# EAGLE schematic MARK-II board (EAGLE 8.5.0)

## Sheet 1 of 6
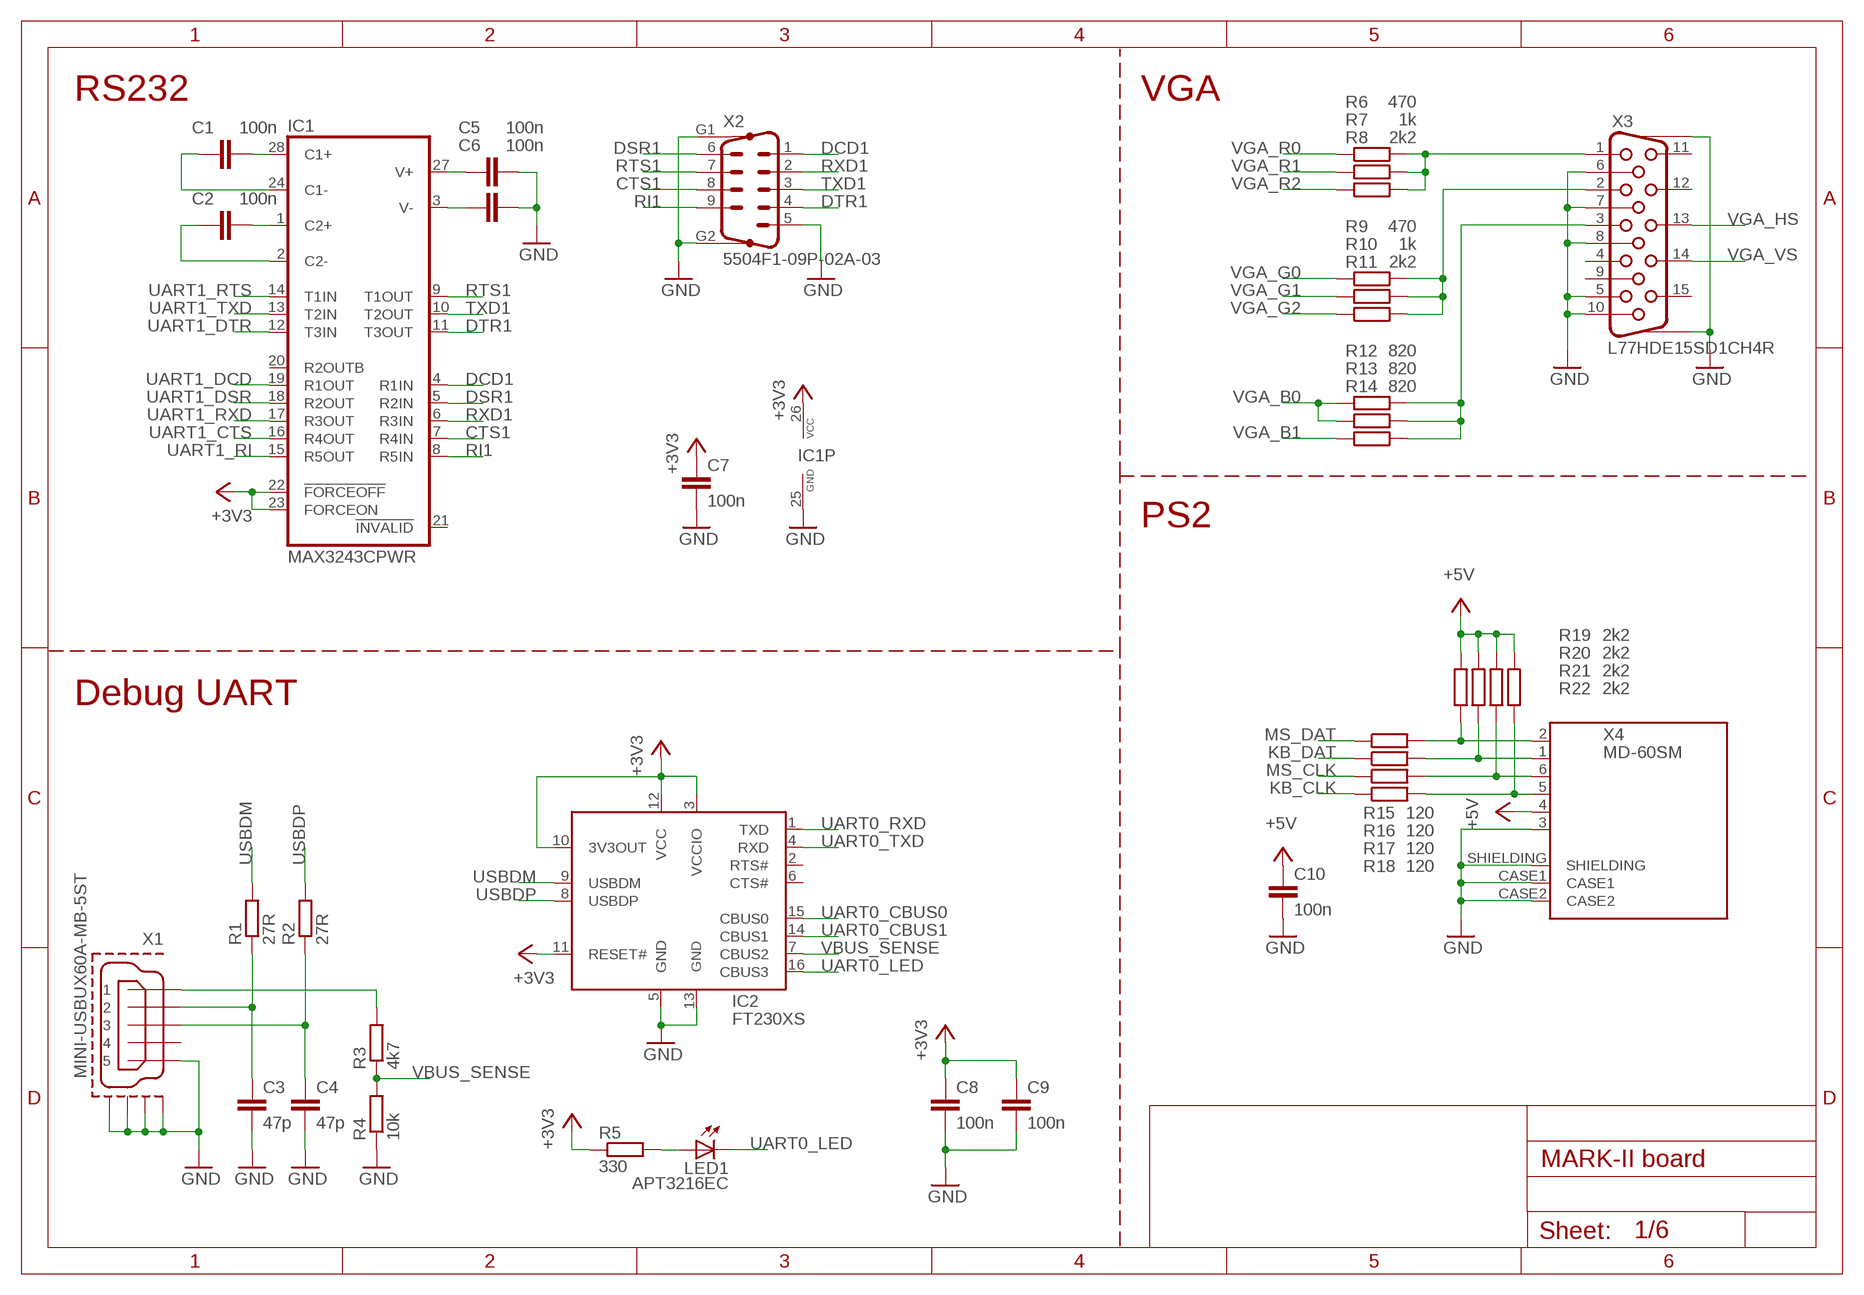
[diagram p0: schematic, sheet 1]

### Parts
C1  100n  CC0603  [C0603]
C2  100n  CC0603  [C0603]
C3  47p  CC0603  [C0603]
C4  47p  CC0603  [C0603]
C5  100n  CC0603  [C0603]
C6  100n  CC0603  [C0603]
C7  100n  CC0603  [C0603]
C8  100n  CC0603  [C0603]
C9  100n  CC0603  [C0603]
C10  100n  CC0603  [C0603]
IC1  MAX3243CPWR  MAX3243UI  [TSSOP28]
IC2  FT230XS  [SSOP16]
LED1  APT3216EC  LEDSMD  [1206]
R1  27R  RR0603  [R0603]
R2  27R  RR0603  [R0603]
R3  4k7  RR0603  [R0603]
R4  10k  RR0603  [R0603]
R5  330  RR0603  [R0603]
R6  470  RR0603  [R0603]
R7  1k  RR0603  [R0603]
R8  2k2  RR0603  [R0603]
R9  470  RR0603  [R0603]
R10  1k  RR0603  [R0603]
R11  2k2  RR0603  [R0603]
R12  820  RR0603  [R0603]
R13  820  RR0603  [R0603]
R14  820  RR0603  [R0603]
R15  120  RR0603  [R0603]
R16  120  RR0603  [R0603]
R17  120  RR0603  [R0603]
R18  120  RR0603  [R0603]
R19  2k2  RR0603  [R0603]
R20  2k2  RR0603  [R0603]
R21  2k2  RR0603  [R0603]
R22  2k2  RR0603  [R0603]
X1  MINI-USBUX60A-MB-5ST  [UX60A-MB-5ST]
X2  5504F1-09P-02A-03  M09  [M09HP]
X3  L77HDE15SD1CH4R  HF15H  [HDF15H]
X4  MD-60SM  MINIDIN_6  [MINIDIN_6_3GND]

### Nets
+3V3 [power]: C7.1 C8.1 C9.1 IC1.22(!FORCEOFF) IC1.23(FORCEON) IC1.26(VCC) IC2.3(VCCIO) IC2.10(3V3OUT) IC2.11(RESET#) IC2.12(VCC) R5.1 ; also sheet 2,3,4,5,6
+5V [power]: C10.1 R19.2 R20.2 R21.2 R22.2 X4.4 ; also sheet 4,6
CTS1 [signal]: IC1.7(R4IN) X2.8
DCD1 [signal]: IC1.4(R1IN) X2.1
DSR1 [signal]: IC1.5(R2IN) X2.6
DTR1 [signal]: IC1.11(T3OUT) X2.4
GND [power]: C3.2 C4.2 C5.2 C6.2 C7.2 C8.2 C9.2 C10.2 IC1.25(GND) IC2.5(GND) IC2.13(GND_1) R4.1 X1.5 X1.M1(GND1) X1.M2(GND2) X1.M3(GND3) X1.M4(GND4) X2.5 X2.G1 X2.G2 X3.5 X3.6 X3.7 X3.8 X3.10 X3.SCH1 X3.SCH2 X4.3 X4.CASE1 X4.CASE2 X4.SHIELDING ; also sheet 2,3,4,5,6
KB_CLK [signal]: R18.1 ; also sheet 5
KB_DAT [signal]: R16.1 ; also sheet 5
MS_CLK [signal]: R17.1 ; also sheet 5
MS_DAT [signal]: R15.1 ; also sheet 5
N$1 [signal]: C1.2 IC1.28(C1+)
N$2 [signal]: C2.2 IC1.1(C2+)
N$3 [signal]: C1.1 IC1.24(C1-)
N$4 [signal]: R16.2 R20.1 X4.1
N$5 [signal]: R12.2 R13.2 R14.2 X3.3
N$6 [signal]: C2.1 IC1.2(C2-)
N$7 [signal]: C5.1 IC1.27(V+)
N$8 [signal]: C6.1 IC1.3(V-)
N$9 [signal]: R18.2 R22.1 X4.5
N$10 [signal]: R9.2 R10.2 R11.2 X3.2
N$13 [signal]: R6.2 R7.2 R8.2 X3.1
N$20 [signal]: R3.2 X1.1
N$23 [signal]: C3.1 R1.1 X1.2
N$24 [signal]: C4.1 R2.1 X1.3
N$33 [signal]: R17.2 R21.1 X4.6
N$34 [signal]: R15.2 R19.1 X4.2
N$36 [signal]: LED1.A R5.2
RI1 [signal]: IC1.8(R5IN) X2.9
RTS1 [signal]: IC1.9(T1OUT) X2.7
RXD1 [signal]: IC1.6(R3IN) X2.2
TXD1 [signal]: IC1.10(T2OUT) X2.3
UART0_CBUS0 [signal]: IC2.15(CBUS0) ; also sheet 5
UART0_CBUS1 [signal]: IC2.14(CBUS1) ; also sheet 5
UART0_LED [signal]: IC2.16(CBUS3) LED1.C ; also sheet 4
UART0_RXD [signal]: IC2.1(TXD) ; also sheet 5
UART0_TXD [signal]: IC2.4(RXD) ; also sheet 5
UART1_CTS [signal]: IC1.16(R4OUT) ; also sheet 5
UART1_DCD [signal]: IC1.19(R1OUT) ; also sheet 5
UART1_DSR [signal]: IC1.18(R2OUT) ; also sheet 5
UART1_DTR [signal]: IC1.12(T3IN) ; also sheet 5
UART1_RI [signal]: IC1.15(R5OUT) ; also sheet 5
UART1_RTS [signal]: IC1.14(T1IN) ; also sheet 5
UART1_RXD [signal]: IC1.17(R3OUT) ; also sheet 5
UART1_TXD [signal]: IC1.13(T2IN) ; also sheet 5
USBDM [signal]: IC2.9(USBDM) R1.2
USBDP [signal]: IC2.8(USBDP) R2.2
VBUS_SENSE [signal]: IC2.7(CBUS2) R3.1 R4.2
VGA_B0 [signal]: R12.1 R13.1 ; also sheet 5
VGA_B1 [signal]: R14.1 ; also sheet 5
VGA_G0 [signal]: R9.1 ; also sheet 5
VGA_G1 [signal]: R10.1 ; also sheet 5
VGA_G2 [signal]: R11.1 ; also sheet 5
VGA_HS [signal]: X3.13 ; also sheet 5
VGA_R0 [signal]: R6.1 ; also sheet 5
VGA_R1 [signal]: R7.1 ; also sheet 5
VGA_R2 [signal]: R8.1 ; also sheet 5
VGA_VS [signal]: X3.14 ; also sheet 5
Unconnected: IC1.20(R2OUTB) IC1.21(!INVALID) IC2.2(RTS#) IC2.6(CTS#) X1.4 X3.4 X3.9 X3.11 X3.12 X3.15

### Notes on the sheet
- RS232 | VGA
- PS2
- Debug UART

## Sheet 2 of 6
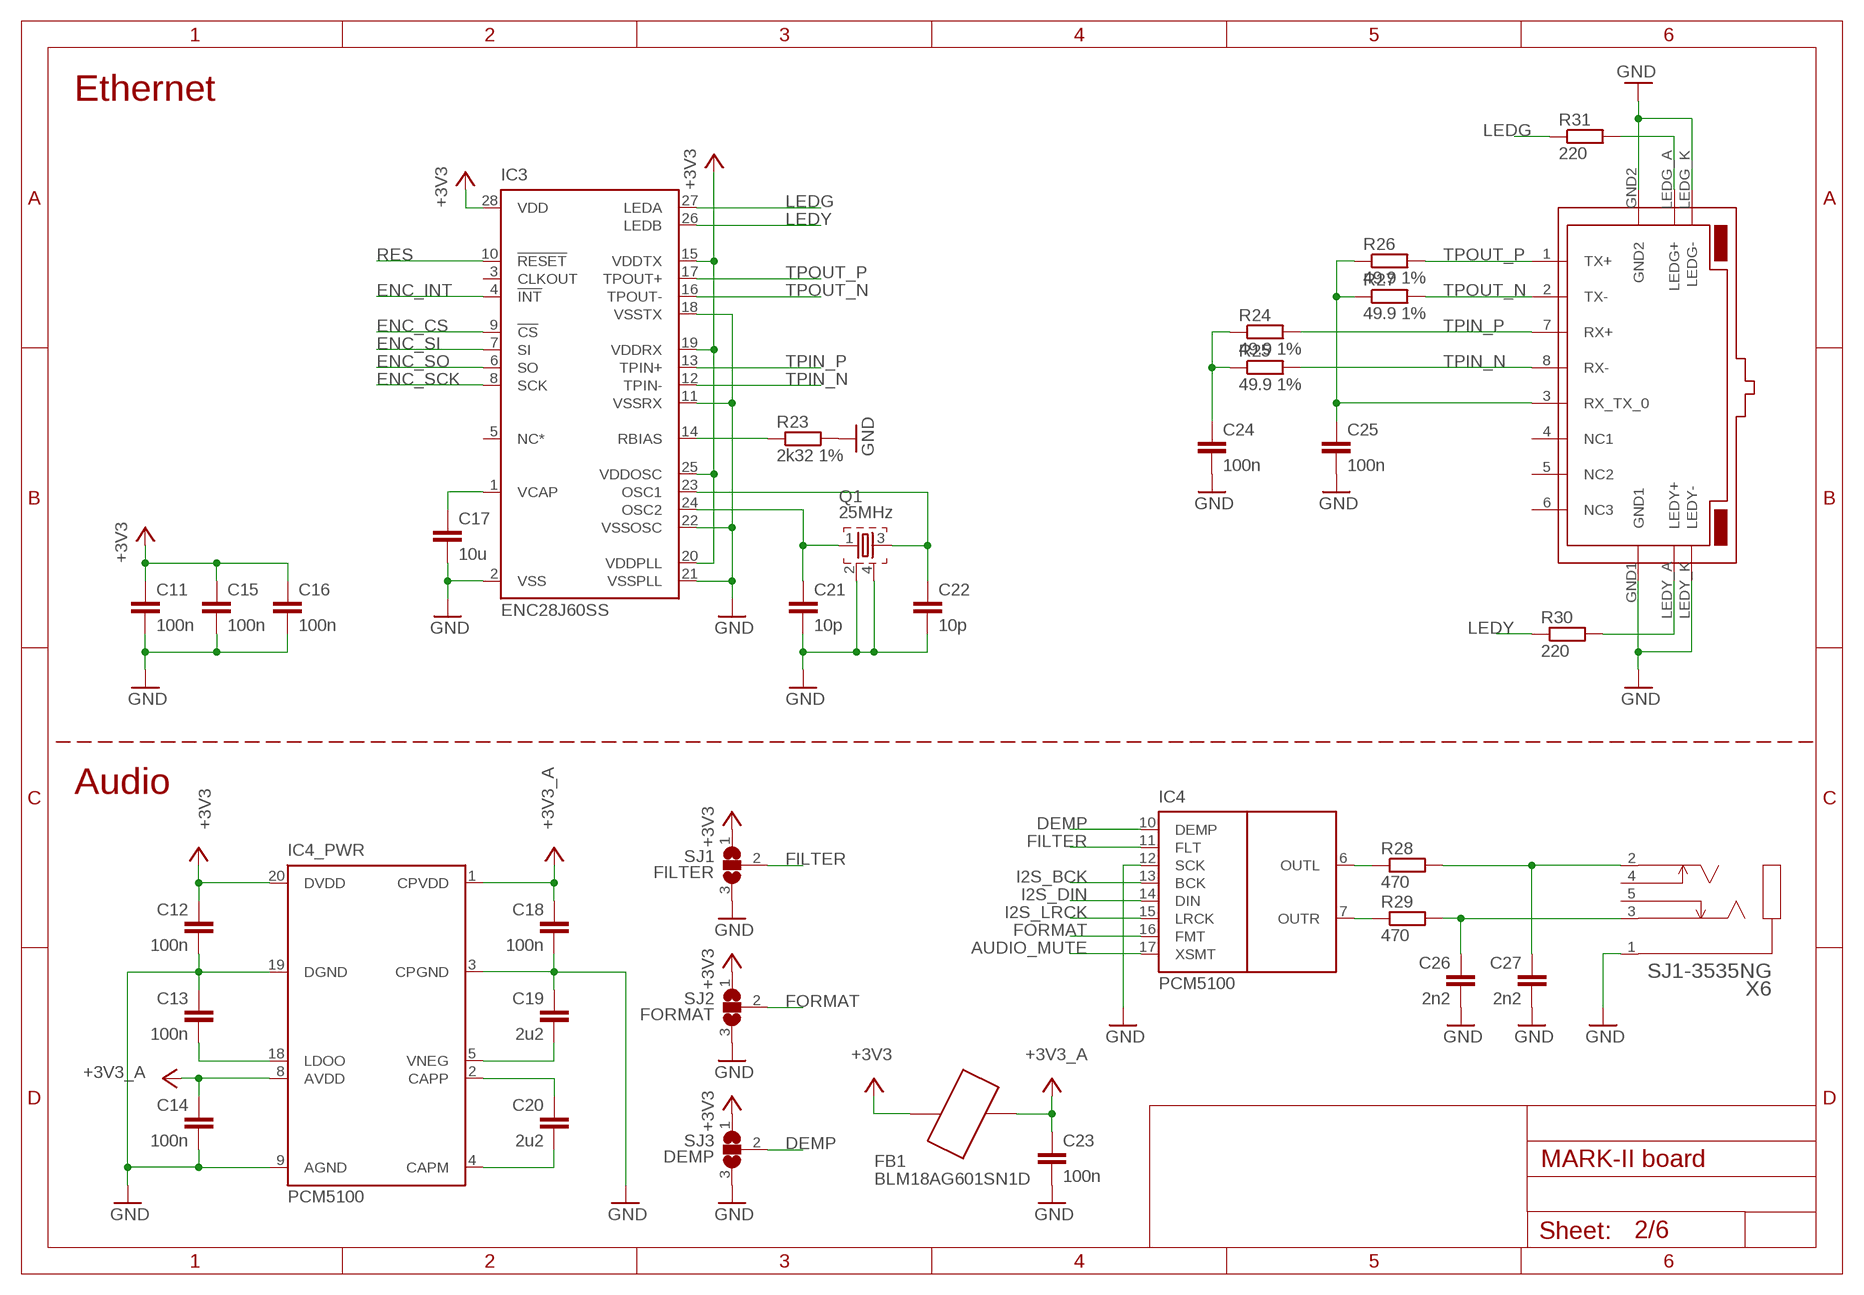
[diagram p1: schematic, sheet 2]

### Parts
C11  100n  CC0603  [C0603]
C12  100n  CC0603  [C0603]
C13  100n  CC0603  [C0603]
C14  100n  CC0603  [C0603]
C15  100n  CC0603  [C0603]
C16  100n  CC0603  [C0603]
C17  10u  CC0603  [C0603]
C18  100n  CC0603  [C0603]
C19  2u2  CC0603  [C0603]
C20  2u2  CC0603  [C0603]
C21  10p  CC0603  [C0603]
C22  10p  CC0603  [C0603]
C23  100n  CC0603  [C0603]
C24  100n  CC0603  [C0603]
C25  100n  CC0603  [C0603]
C26  2n2  CC0603  [C0603]
C27  2n2  CC0603  [C0603]
FB1  BLM18AG601SN1D  FERRITE_BEAD603  [R0603]
IC3  ENC28J60SS  [SSOP28]
IC4  PCM5100  [TSSOP20]
Q1  25MHz  CRYSTALS-GND-LID-CFPX-180  [3.4X2.7-4-PAD]
R23  2k32 1%  RR0603  [R0603]
R24  49.9 1%  RR0603  [R0603]
R25  49.9 1%  RR0603  [R0603]
R26  49.9 1%  RR0603  [R0603]
R27  49.9 1%  RR0603  [R0603]
R28  470  RR0603  [R0603]
R29  470  RR0603  [R0603]
R30  220  RR0603  [R0603]
R31  220  RR0603  [R0603]
SJ1  FILTER  SJ2W  [SJ_2]
SJ2  FORMAT  SJ2W  [SJ_2]
SJ3  DEMP  SJ2W  [SJ_2]
X5  RB1-125BAG1A  [RB1-125BAG1A]
X6  SJ1-3535NG  [JACK]

### Nets
+3V3 [power]: C11.1 C12.1 C15.1 C16.1 FB1.1 IC3.15(VDDTX) IC3.19(VDDRX) IC3.20(VDDPLL) IC3.25(VDDOSC) IC3.28(VDD) IC4.20(DVDD) SJ1.1 SJ2.1 SJ3.1 ; also sheet 1,3,4,5,6
+3V3_A [power]: C14.1 C18.1 C23.1 FB1.2 IC4.1(CPVDD) IC4.8(AVDD)
AUDIO_MUTE [signal]: IC4.17(XSMT) ; also sheet 6
DEMP [signal]: IC4.10(DEMP) SJ3.2
ENC_CS [signal]: IC3.9(!CS) ; also sheet 5
ENC_INT [signal]: IC3.4(!INT) ; also sheet 5
ENC_SCK [signal]: IC3.8(SCK) ; also sheet 5
ENC_SI [signal]: IC3.7(SI) ; also sheet 5
ENC_SO [signal]: IC3.6(SO) ; also sheet 5
FILTER [signal]: IC4.11(FLT) SJ1.2
FORMAT [signal]: IC4.16(FMT) SJ2.2
GND [power]: C11.2 C12.2 C13.1 C14.2 C15.2 C16.2 C17.2 C18.2 C19.1 C21.2 C22.2 C23.2 C24.2 C25.2 C26.2 C27.2 IC3.2(VSS) IC3.11(VSSRX) IC3.18(VSSTX) IC3.21(VSSPLL) IC3.22(VSSOSC) IC4.3(CPGND) IC4.9(AGND) IC4.12(SCK) IC4.19(DGND) Q1.2 Q1.4 R23.2 SJ1.3 SJ2.3 SJ3.3 X5.GND1 X5.GND2 X5.LEDG_K(LEDG-) X5.LEDY_K(LEDY-) X6.1(SLEEVE) ; also sheet 1,3,4,5,6
I2S_BCK [signal]: IC4.13(BCK) ; also sheet 5
I2S_DIN [signal]: IC4.14(DIN) ; also sheet 5
I2S_LRCK [signal]: IC4.15(LRCK) ; also sheet 5
LEDG [signal]: IC3.27(LEDA) R31.1
LEDY [signal]: IC3.26(LEDB) R30.1
N$11 [signal]: C24.1 R24.1 R25.1
N$12 [signal]: C17.1 IC3.1(VCAP)
N$14 [signal]: R30.2 X5.LEDY_A(LEDY+)
N$15 [signal]: R31.2 X5.LEDG_A(LEDG+)
N$16 [signal]: C25.1 R26.1 R27.1 X5.3(RX_TX_0)
N$17 [signal]: IC3.14(RBIAS) R23.1
N$18 [signal]: C21.1 IC3.24(OSC2) Q1.1
N$19 [signal]: C22.1 IC3.23(OSC1) Q1.3
N$38 [signal]: C20.1 IC4.2(CAPP)
N$39 [signal]: C20.2 IC4.4(CAPM)
N$40 [signal]: C13.2 IC4.18(LDOO)
N$41 [signal]: IC4.6(OUTL) R28.1
N$42 [signal]: IC4.7(OUTR) R29.1
N$43 [signal]: C27.1 R28.2 X6.2(TIP)
N$44 [signal]: C26.1 R29.2 X6.3(RING)
N$45 [signal]: C19.2 IC4.5(VNEG)
RES [signal]: IC3.10(!RESET) ; also sheet 4,5
TPIN_N [signal]: IC3.12(TPIN-) R25.2 X5.8(RX-)
TPIN_P [signal]: IC3.13(TPIN+) R24.2 X5.7(RX+)
TPOUT_N [signal]: IC3.16(TPOUT-) R27.2 X5.2(TX-)
TPOUT_P [signal]: IC3.17(TPOUT+) R26.2 X5.1(TX+)
Unconnected: IC3.3(CLKOUT) IC3.5(NC*) X5.4(NC1) X5.5(NC2) X5.6(NC3) X6.4(TIP_SW) X6.5(RING_SW)

### Notes on the sheet
- Ethernet
- Audio

## Sheet 3 of 6
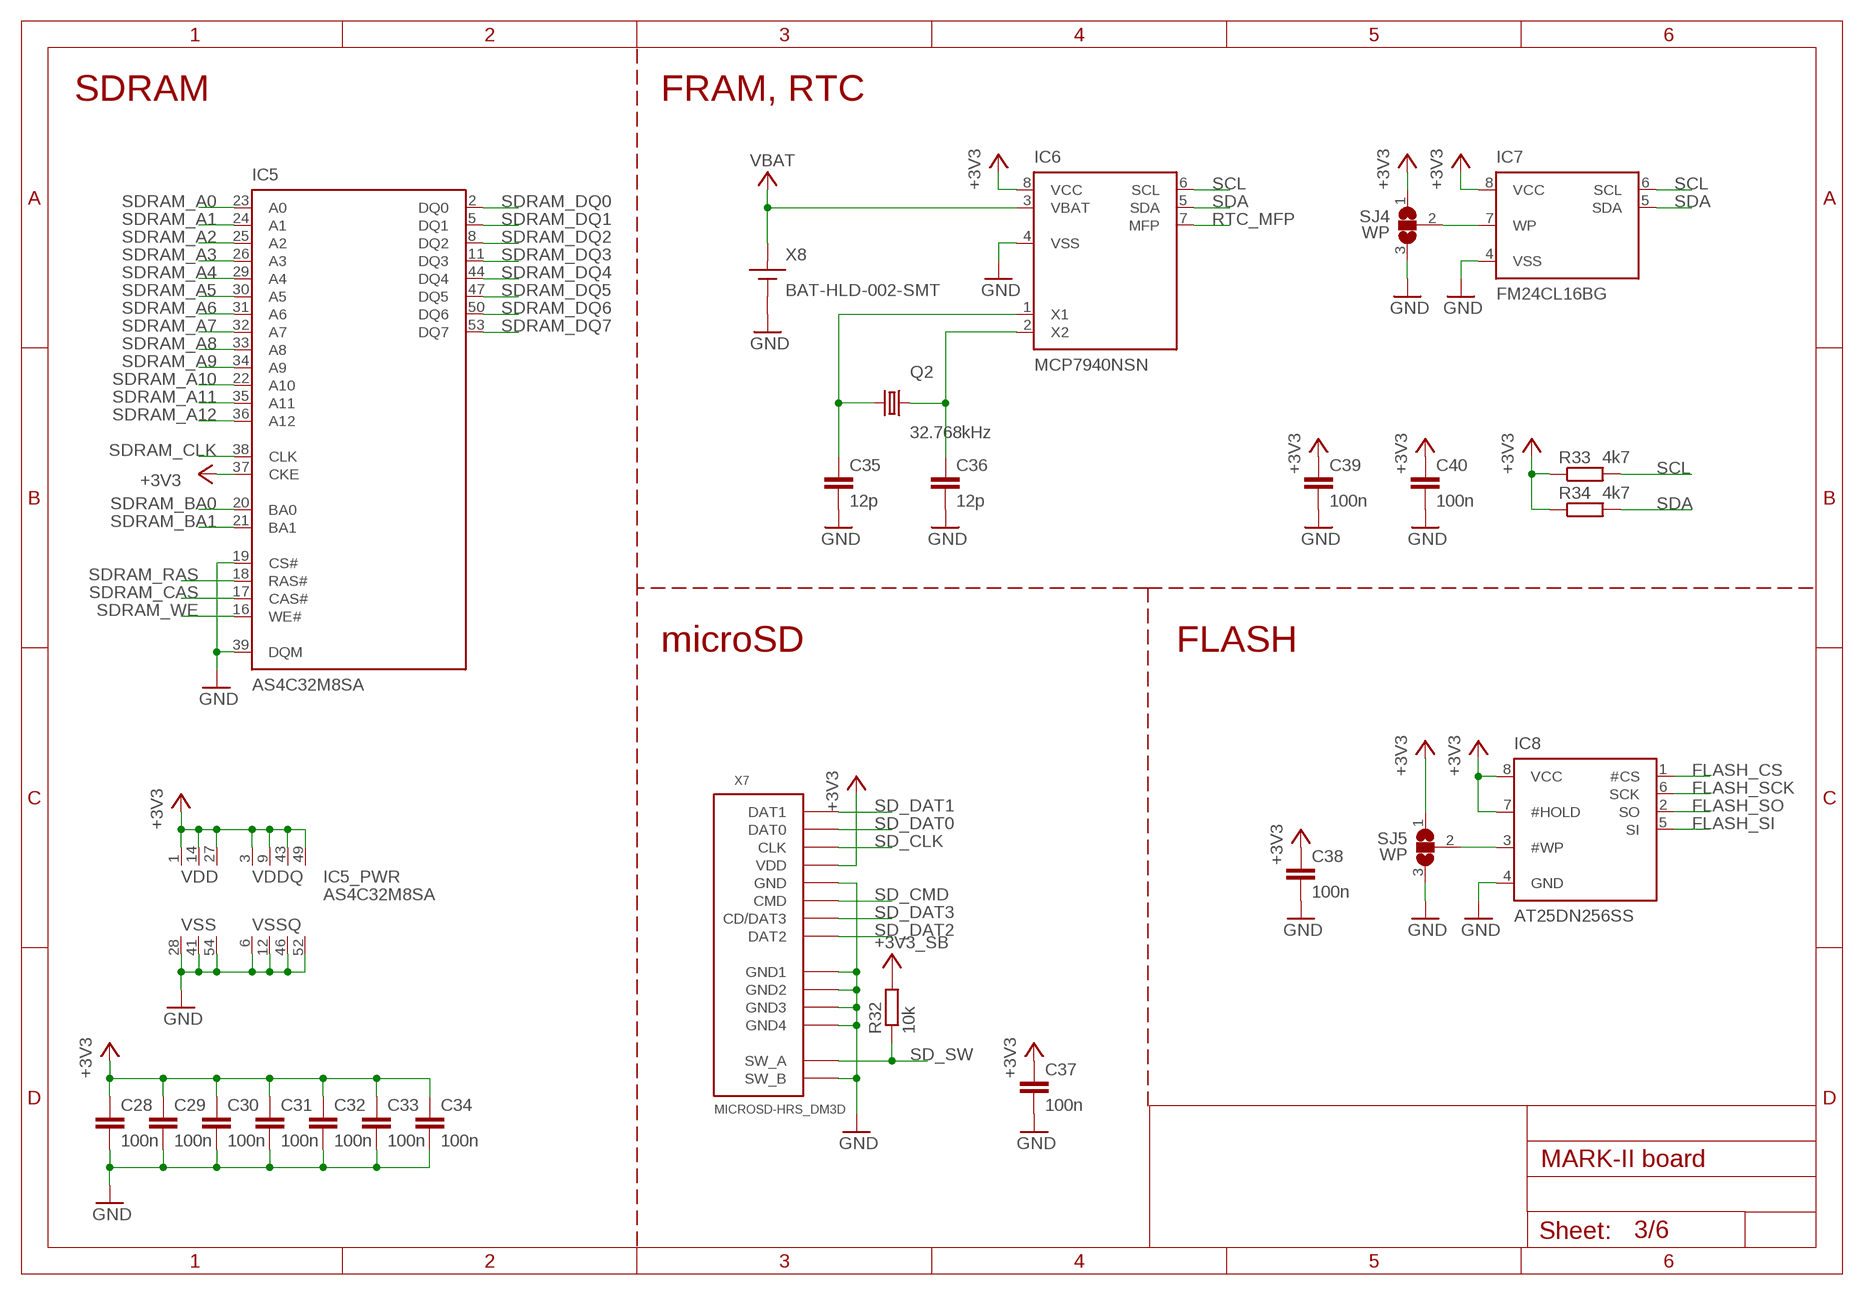
[diagram p2: schematic, sheet 3]

### Parts
C28  100n  CC0603  [C0603]
C29  100n  CC0603  [C0603]
C30  100n  CC0603  [C0603]
C31  100n  CC0603  [C0603]
C32  100n  CC0603  [C0603]
C33  100n  CC0603  [C0603]
C34  100n  CC0603  [C0603]
C35  12p  CC0603  [C0603]
C36  12p  CC0603  [C0603]
C37  100n  CC0603  [C0603]
C38  100n  CC0603  [C0603]
C39  100n  CC0603  [C0603]
C40  100n  CC0603  [C0603]
IC5  AS4C32M8SA  IS42S83200  [TSOP54]
IC6  MCP7940NSN  [SOIC8]
IC7  FM24CL16BG  [SOIC8]
IC8  AT25DN256SS  [SOIC8]
Q2  32.768kHz  CRYSTALS-NOGND-85SMX  [85SMX]
R32  10k  RR0603  [R0603]
R33  4k7  RR0603  [R0603]
R34  4k7  RR0603  [R0603]
SJ4  WP  SJ2W  [SJ_2]
SJ5  WP  SJ2W  [SJ_2]
X7  MICROSD-HRS_DM3D  [DM3D]
X8  BAT-HLD-002-SMT  [BAT-HLD-002-SMT]

### Nets
+3V3 [power]: C28.1 C29.1 C30.1 C31.1 C32.1 C33.1 C34.1 C37.1 C38.1 C39.1 C40.1 IC5.1(VDD0) IC5.3(VDDQ0) IC5.9(VDDQ1) IC5.14(VDD1) IC5.27(VDD2) IC5.37(CKE) IC5.43(VDDQ2) IC5.49(VDDQ3) IC6.8(VCC) IC7.8(VCC) IC8.7(#HOLD) IC8.8(VCC) R33.1 R34.1 SJ4.1 SJ5.1 X7.VDD ; also sheet 1,2,4,5,6
+3V3_SB [power]: R32.2 ; also sheet 6
FLASH_CS [signal]: IC8.1(#CS) ; also sheet 5
FLASH_SCK [signal]: IC8.6(SCK) ; also sheet 5
FLASH_SI [signal]: IC8.5(SI) ; also sheet 5
FLASH_SO [signal]: IC8.2(SO) ; also sheet 5
GND [power]: C28.2 C29.2 C30.2 C31.2 C32.2 C33.2 C34.2 C35.2 C36.2 C37.2 C38.2 C39.2 C40.2 IC5.6(VSSQ0) IC5.12(VSSQ1) IC5.19(CS#) IC5.28(VSS0) IC5.39(DQM) IC5.41(VSS1) IC5.46(VSSQ2) IC5.52(VSSQ3) IC5.54(VSS2) IC6.4(VSS) IC7.4(VSS) IC8.4(GND) SJ4.3 SJ5.3 X7.GND1 X7.GND2 X7.GND3 X7.GND4 X7.SW_B X7.VSS(GND) X8.N ; also sheet 1,2,4,5,6
N$25 [signal]: C35.1 IC6.1(X1) Q2.4
N$26 [signal]: C36.1 IC6.2(X2) Q2.1
N$35 [signal]: IC7.7(WP) SJ4.2
N$37 [signal]: IC8.3(#WP) SJ5.2
RTC_MFP [signal]: IC6.7(MFP) ; also sheet 5
SCL [signal]: IC6.6(SCL) IC7.6(SCL) R33.2 ; also sheet 5
SD_CLK [signal]: X7.CLK ; also sheet 5
SD_CMD [signal]: X7.CMD ; also sheet 5
SD_DAT0 [signal]: X7.DAT0 ; also sheet 5
SD_DAT1 [signal]: X7.DAT1 ; also sheet 5
SD_DAT2 [signal]: X7.DAT2 ; also sheet 5
SD_DAT3 [signal]: X7.CD/DAT3 ; also sheet 5
SD_SW [signal]: R32.1 X7.SW_A ; also sheet 6
SDA [signal]: IC6.5(SDA) IC7.5(SDA) R34.2 ; also sheet 5
SDRAM_A0 [sdram]: IC5.23(A0) ; also sheet 5
SDRAM_A1 [sdram]: IC5.24(A1) ; also sheet 5
SDRAM_A2 [sdram]: IC5.25(A2) ; also sheet 5
SDRAM_A3 [sdram]: IC5.26(A3) ; also sheet 5
SDRAM_A4 [sdram]: IC5.29(A4) ; also sheet 5
SDRAM_A5 [sdram]: IC5.30(A5) ; also sheet 5
SDRAM_A6 [sdram]: IC5.31(A6) ; also sheet 5
SDRAM_A7 [sdram]: IC5.32(A7) ; also sheet 5
SDRAM_A8 [sdram]: IC5.33(A8) ; also sheet 5
SDRAM_A9 [sdram]: IC5.34(A9) ; also sheet 5
SDRAM_A10 [sdram]: IC5.22(A10) ; also sheet 5
SDRAM_A11 [sdram]: IC5.35(A11) ; also sheet 5
SDRAM_A12 [sdram]: IC5.36(A12) ; also sheet 5
SDRAM_BA0 [sdram]: IC5.20(BA0) ; also sheet 5
SDRAM_BA1 [sdram]: IC5.21(BA1) ; also sheet 5
SDRAM_CAS [sdram]: IC5.17(CAS#) ; also sheet 5
SDRAM_CLK [sdram]: IC5.38(CLK) ; also sheet 5
SDRAM_DQ0 [sdram]: IC5.2(DQ0) ; also sheet 5
SDRAM_DQ1 [sdram]: IC5.5(DQ1) ; also sheet 5
SDRAM_DQ2 [sdram]: IC5.8(DQ2) ; also sheet 5
SDRAM_DQ3 [sdram]: IC5.11(DQ3) ; also sheet 5
SDRAM_DQ4 [sdram]: IC5.44(DQ4) ; also sheet 5
SDRAM_DQ5 [sdram]: IC5.47(DQ5) ; also sheet 5
SDRAM_DQ6 [sdram]: IC5.50(DQ6) ; also sheet 5
SDRAM_DQ7 [sdram]: IC5.53(DQ7) ; also sheet 5
SDRAM_RAS [sdram]: IC5.18(RAS#) ; also sheet 5
SDRAM_WE [sdram]: IC5.16(WE#) ; also sheet 5
VBAT [vbat]: IC6.3(VBAT) X8.P1(P) ; also sheet 6
Unconnected: IC7.1(NC1) IC7.2(NC2) IC7.3(NC3)

### Notes on the sheet
- SDRAM | FRAM, RTC
- microSD | FLASH

## Sheet 4 of 6
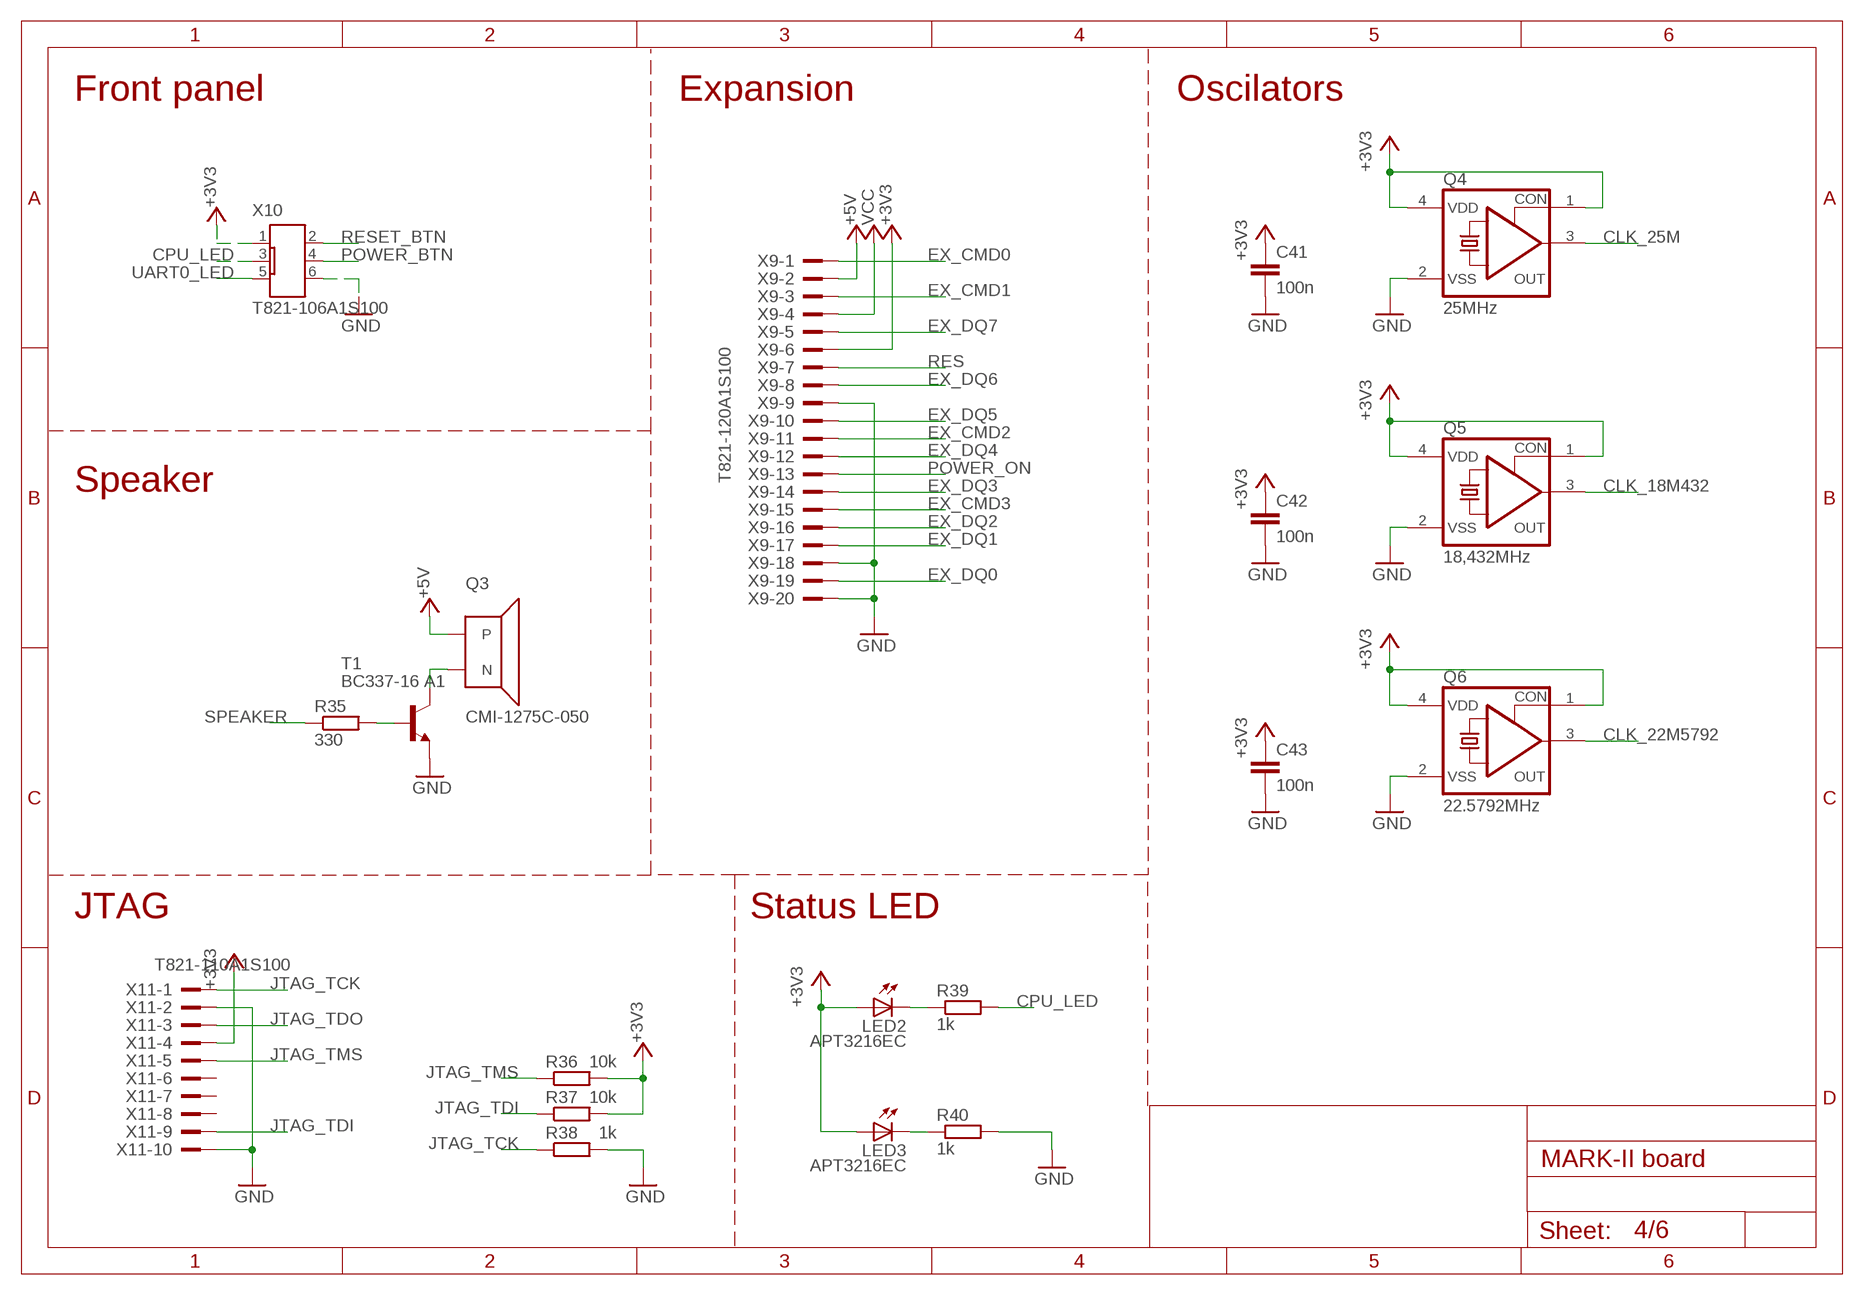
[diagram p3: schematic, sheet 4]

### Parts
C41  100n  CC0603  [C0603]
C42  100n  CC0603  [C0603]
C43  100n  CC0603  [C0603]
LED2  APT3216EC  LEDSMD  [1206]
LED3  APT3216EC  LEDSMD  [1206]
Q3  CMI-1275C-050  [BUUZZER]
Q4  25MHz  OSC-OE-CFPS-9  [5.2X3.4-4-PAD]
Q5  18,432MHz  OSC-OE-CFPS-9  [5.2X3.4-4-PAD]
Q6  22.5792MHz  OSC-OE-CFPS-9  [5.2X3.4-4-PAD]
R35  330  RR0603  [R0603]
R36  10k  RR0603  [R0603]
R37  10k  RR0603  [R0603]
R38  1k  RR0603  [R0603]
R39  1k  RR0603  [R0603]
R40  1k  RR0603  [R0603]
T1  BC337-16 A1  BC337  [TO92]
X9  T821-120A1S100  2520-  [PAK100/2500-20]
X10  T821-106A1S100  IDC_2306  [PAK100/2300-06]
X11  T821-110A1S100  2510-  [PAK100/2500-10]

### Nets
+3V3 [power]: C41.1 C42.1 C43.1 LED2.A LED3.A Q4.1(CON) Q4.4(VDD) Q5.1(CON) Q5.4(VDD) Q6.1(CON) Q6.4(VDD) R36.2 R37.2 X9.6 X10.1 X11.4 ; also sheet 1,2,3,5,6
+5V [power]: Q3.P X9.2 ; also sheet 1,6
CLK_18M432 [signal]: Q5.3(OUT) ; also sheet 5
CLK_22M5792 [signal]: Q6.3(OUT) ; also sheet 5
CLK_25M [signal]: Q4.3(OUT) ; also sheet 5
CPU_LED [signal]: R39.2 X10.3 ; also sheet 6
EX_CMD0 [signal]: X9.1 ; also sheet 5
EX_CMD1 [signal]: X9.3 ; also sheet 5
EX_CMD2 [signal]: X9.11 ; also sheet 5
EX_CMD3 [signal]: X9.15 ; also sheet 5
EX_DQ0 [signal]: X9.19 ; also sheet 5
EX_DQ1 [signal]: X9.17 ; also sheet 5
EX_DQ2 [signal]: X9.16 ; also sheet 5
EX_DQ3 [signal]: X9.14 ; also sheet 5
EX_DQ4 [signal]: X9.12 ; also sheet 5
EX_DQ5 [signal]: X9.10 ; also sheet 5
EX_DQ6 [signal]: X9.8 ; also sheet 5
EX_DQ7 [signal]: X9.5 ; also sheet 5
GND [power]: C41.2 C42.2 C43.2 Q4.2(VSS) Q5.2(VSS) Q6.2(VSS) R38.2 R40.2 T1.1(E) X9.9 X9.18 X9.20 X10.6 X11.2 X11.10 ; also sheet 1,2,3,5,6
JTAG_TCK [signal]: R38.1 X11.1 ; also sheet 5
JTAG_TDI [signal]: R37.1 X11.9 ; also sheet 5
JTAG_TDO [signal]: X11.3 ; also sheet 5
JTAG_TMS [signal]: R36.1 X11.5 ; also sheet 5
N$22 [signal]: LED3.C R40.1
N$27 [signal]: LED2.C R39.1
N$31 [signal]: Q3.N T1.3(C)
N$32 [signal]: R35.2 T1.2(B)
POWER_BTN [signal]: X10.4 ; also sheet 6
POWER_ON [signal]: X9.13 ; also sheet 6
RES [signal]: X9.7 ; also sheet 2,5
RESET_BTN [signal]: X10.2 ; also sheet 6
SPEAKER [signal]: R35.1 ; also sheet 6
UART0_LED [signal]: X10.5 ; also sheet 1
VCC [power]: X9.4 ; also sheet 6
Unconnected: X11.6 X11.7 X11.8

### Notes on the sheet
- Front panel | Expansion | Oscilators
- Speaker
- JTAG | Status LED

## Sheet 5 of 6
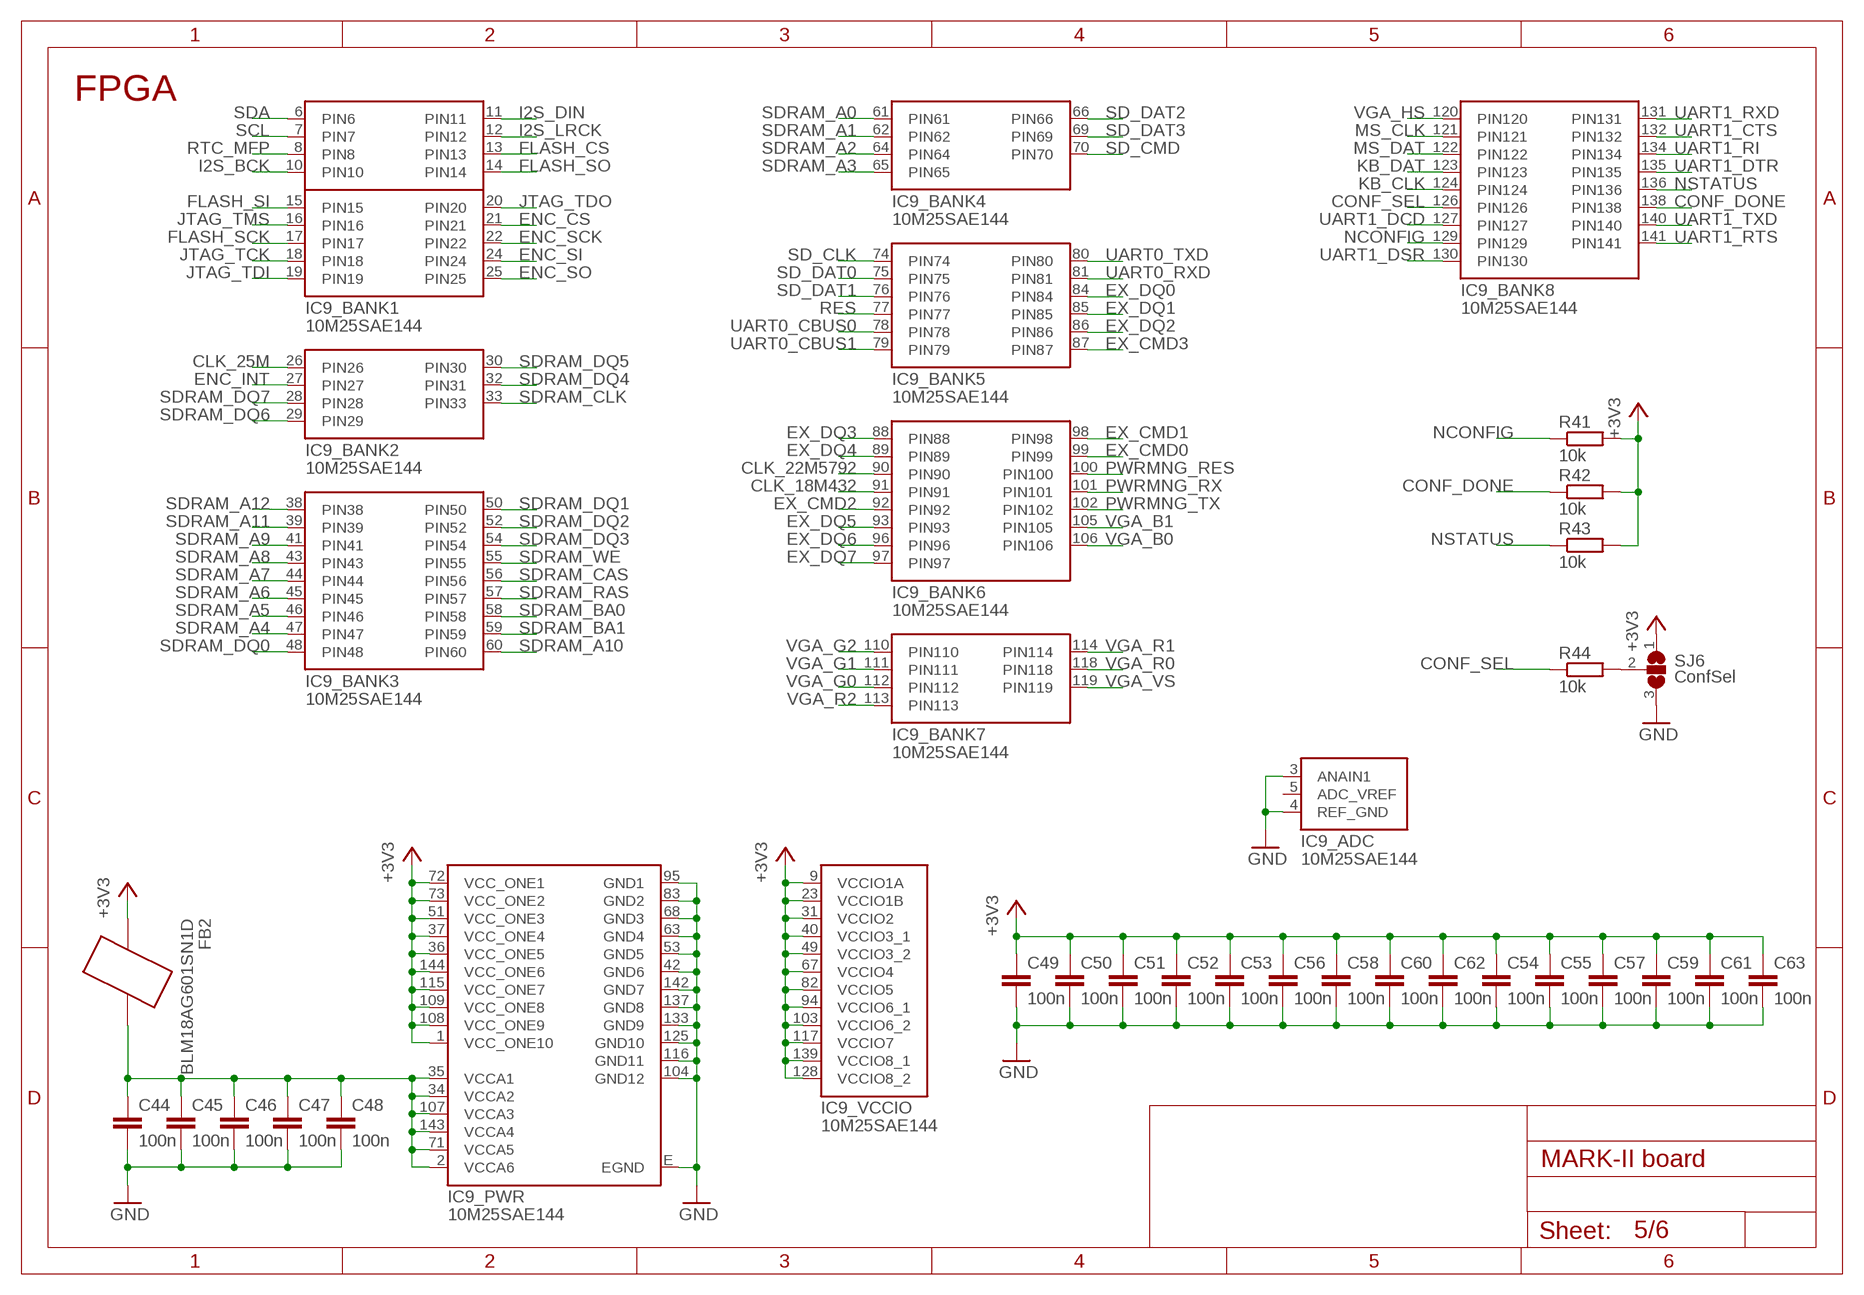
[diagram p4: schematic, sheet 5]

### Parts
C44  100n  CC0603  [C0603]
C45  100n  CC0603  [C0603]
C46  100n  CC0603  [C0603]
C47  100n  CC0603  [C0603]
C48  100n  CC0603  [C0603]
C49  100n  CC0603  [C0603]
C50  100n  CC0603  [C0603]
C51  100n  CC0603  [C0603]
C52  100n  CC0603  [C0603]
C53  100n  CC0603  [C0603]
C54  100n  CC0603  [C0603]
C55  100n  CC0603  [C0603]
C56  100n  CC0603  [C0603]
C57  100n  CC0603  [C0603]
C58  100n  CC0603  [C0603]
C59  100n  CC0603  [C0603]
C60  100n  CC0603  [C0603]
C61  100n  CC0603  [C0603]
C62  100n  CC0603  [C0603]
C63  100n  CC0603  [C0603]
FB2  BLM18AG601SN1D  FERRITE_BEAD603  [R0603]
IC9  10M25SAE144  [EQFP144]
R41  10k  RR0603  [R0603]
R42  10k  RR0603  [R0603]
R43  10k  RR0603  [R0603]
R44  10k  RR0603  [R0603]
SJ6  ConfSel  SJ2W  [SJ_2]

### Nets
+3V3 [power]: C49.1 C50.1 C51.1 C52.1 C53.1 C54.1 C55.1 C56.1 C57.1 C58.1 C59.1 C60.1 C61.1 C62.1 C63.1 FB2.1 IC9.1(_PWR:VCC_ONE10) IC9.9(_VCCIO:VCCIO1A) IC9.23(_VCCIO:VCCIO1B) IC9.31(_VCCIO:VCCIO2) IC9.36(_PWR:VCC_ONE5) IC9.37(_PWR:VCC_ONE4) IC9.40(_VCCIO:VCCIO3_1) IC9.49(_VCCIO:VCCIO3_2) IC9.51(_PWR:VCC_ONE3) IC9.67(_VCCIO:VCCIO4) IC9.72(_PWR:VCC_ONE1) IC9.73(_PWR:VCC_ONE2) IC9.82(_VCCIO:VCCIO5) IC9.94(_VCCIO:VCCIO6_1) IC9.103(_VCCIO:VCCIO6_2) IC9.108(_PWR:VCC_ONE9) IC9.109(_PWR:VCC_ONE8) IC9.115(_PWR:VCC_ONE7) IC9.117(_VCCIO:VCCIO7) IC9.128(_VCCIO:VCCIO8_2) IC9.139(_VCCIO:VCCIO8_1) IC9.144(_PWR:VCC_ONE6) R41.2 R42.2 R43.2 SJ6.1 ; also sheet 1,2,3,4,6
CLK_18M432 [signal]: IC9.91(_BANK6:PIN91) ; also sheet 4
CLK_22M5792 [signal]: IC9.90(_BANK6:PIN90) ; also sheet 4
CLK_25M [signal]: IC9.26(_BANK2:PIN26) ; also sheet 4
CONF_DONE [signal]: IC9.138(_BANK8:PIN138) R42.1
CONF_SEL [signal]: IC9.126(_BANK8:PIN126) R44.1
ENC_CS [signal]: IC9.21(_BANK1:PIN21) ; also sheet 2
ENC_INT [signal]: IC9.27(_BANK2:PIN27) ; also sheet 2
ENC_SCK [signal]: IC9.22(_BANK1:PIN22) ; also sheet 2
ENC_SI [signal]: IC9.24(_BANK1:PIN24) ; also sheet 2
ENC_SO [signal]: IC9.25(_BANK1:PIN25) ; also sheet 2
EX_CMD0 [signal]: IC9.99(_BANK6:PIN99) ; also sheet 4
EX_CMD1 [signal]: IC9.98(_BANK6:PIN98) ; also sheet 4
EX_CMD2 [signal]: IC9.92(_BANK6:PIN92) ; also sheet 4
EX_CMD3 [signal]: IC9.87(_BANK5:PIN87) ; also sheet 4
EX_DQ0 [signal]: IC9.84(_BANK5:PIN84) ; also sheet 4
EX_DQ1 [signal]: IC9.85(_BANK5:PIN85) ; also sheet 4
EX_DQ2 [signal]: IC9.86(_BANK5:PIN86) ; also sheet 4
EX_DQ3 [signal]: IC9.88(_BANK6:PIN88) ; also sheet 4
EX_DQ4 [signal]: IC9.89(_BANK6:PIN89) ; also sheet 4
EX_DQ5 [signal]: IC9.93(_BANK6:PIN93) ; also sheet 4
EX_DQ6 [signal]: IC9.96(_BANK6:PIN96) ; also sheet 4
EX_DQ7 [signal]: IC9.97(_BANK6:PIN97) ; also sheet 4
FLASH_CS [signal]: IC9.13(_BANK1:PIN13) ; also sheet 3
FLASH_SCK [signal]: IC9.17(_BANK1:PIN17) ; also sheet 3
FLASH_SI [signal]: IC9.15(_BANK1:PIN15) ; also sheet 3
FLASH_SO [signal]: IC9.14(_BANK1:PIN14) ; also sheet 3
GND [power]: C44.2 C45.2 C46.2 C47.2 C48.2 C49.2 C50.2 C51.2 C52.2 C53.2 C54.2 C55.2 C56.2 C57.2 C58.2 C59.2 C60.2 C61.2 C62.2 C63.2 IC9.3(_ADC:ANAIN1) IC9.4(_ADC:REF_GND) IC9.42(_PWR:GND6) IC9.53(_PWR:GND5) IC9.63(_PWR:GND4) IC9.68(_PWR:GND3) IC9.83(_PWR:GND2) IC9.95(_PWR:GND1) IC9.104(_PWR:GND12) IC9.116(_PWR:GND11) IC9.125(_PWR:GND10) IC9.133(_PWR:GND9) IC9.137(_PWR:GND8) IC9.142(_PWR:GND7) IC9.E(_PWR:EGND) SJ6.3 ; also sheet 1,2,3,4,6
I2S_BCK [signal]: IC9.10(_BANK1:PIN10) ; also sheet 2
I2S_DIN [signal]: IC9.11(_BANK1:PIN11) ; also sheet 2
I2S_LRCK [signal]: IC9.12(_BANK1:PIN12) ; also sheet 2
JTAG_TCK [signal]: IC9.18(_BANK1:PIN18) ; also sheet 4
JTAG_TDI [signal]: IC9.19(_BANK1:PIN19) ; also sheet 4
JTAG_TDO [signal]: IC9.20(_BANK1:PIN20) ; also sheet 4
JTAG_TMS [signal]: IC9.16(_BANK1:PIN16) ; also sheet 4
KB_CLK [signal]: IC9.124(_BANK8:PIN124) ; also sheet 1
KB_DAT [signal]: IC9.123(_BANK8:PIN123) ; also sheet 1
MS_CLK [signal]: IC9.121(_BANK8:PIN121) ; also sheet 1
MS_DAT [signal]: IC9.122(_BANK8:PIN122) ; also sheet 1
N$29 [signal]: R44.2 SJ6.2
NCONFIG [signal]: IC9.129(_BANK8:PIN129) R41.1
NSTATUS [signal]: IC9.136(_BANK8:PIN136) R43.1
PWRMNG_RES [signal]: IC9.100(_BANK6:PIN100) ; also sheet 6
PWRMNG_RX [signal]: IC9.101(_BANK6:PIN101) ; also sheet 6
PWRMNG_TX [signal]: IC9.102(_BANK6:PIN102) ; also sheet 6
RES [signal]: IC9.77(_BANK5:PIN77) ; also sheet 2,4
RTC_MFP [signal]: IC9.8(_BANK1:PIN8) ; also sheet 3
SCL [signal]: IC9.7(_BANK1:PIN7) ; also sheet 3
SD_CLK [signal]: IC9.74(_BANK5:PIN74) ; also sheet 3
SD_CMD [signal]: IC9.70(_BANK4:PIN70) ; also sheet 3
SD_DAT0 [signal]: IC9.75(_BANK5:PIN75) ; also sheet 3
SD_DAT1 [signal]: IC9.76(_BANK5:PIN76) ; also sheet 3
SD_DAT2 [signal]: IC9.66(_BANK4:PIN66) ; also sheet 3
SD_DAT3 [signal]: IC9.69(_BANK4:PIN69) ; also sheet 3
SDA [signal]: IC9.6(_BANK1:PIN6) ; also sheet 3
SDRAM_A0 [sdram]: IC9.61(_BANK4:PIN61) ; also sheet 3
SDRAM_A1 [sdram]: IC9.62(_BANK4:PIN62) ; also sheet 3
SDRAM_A2 [sdram]: IC9.64(_BANK4:PIN64) ; also sheet 3
SDRAM_A3 [sdram]: IC9.65(_BANK4:PIN65) ; also sheet 3
SDRAM_A4 [sdram]: IC9.47(_BANK3:PIN47) ; also sheet 3
SDRAM_A5 [sdram]: IC9.46(_BANK3:PIN46) ; also sheet 3
SDRAM_A6 [sdram]: IC9.45(_BANK3:PIN45) ; also sheet 3
SDRAM_A7 [sdram]: IC9.44(_BANK3:PIN44) ; also sheet 3
SDRAM_A8 [sdram]: IC9.43(_BANK3:PIN43) ; also sheet 3
SDRAM_A9 [sdram]: IC9.41(_BANK3:PIN41) ; also sheet 3
SDRAM_A10 [sdram]: IC9.60(_BANK3:PIN60) ; also sheet 3
SDRAM_A11 [sdram]: IC9.39(_BANK3:PIN39) ; also sheet 3
SDRAM_A12 [sdram]: IC9.38(_BANK3:PIN38) ; also sheet 3
SDRAM_BA0 [sdram]: IC9.58(_BANK3:PIN58) ; also sheet 3
SDRAM_BA1 [sdram]: IC9.59(_BANK3:PIN59) ; also sheet 3
SDRAM_CAS [sdram]: IC9.56(_BANK3:PIN56) ; also sheet 3
SDRAM_CLK [sdram]: IC9.33(_BANK2:PIN33) ; also sheet 3
SDRAM_DQ0 [sdram]: IC9.48(_BANK3:PIN48) ; also sheet 3
SDRAM_DQ1 [sdram]: IC9.50(_BANK3:PIN50) ; also sheet 3
SDRAM_DQ2 [sdram]: IC9.52(_BANK3:PIN52) ; also sheet 3
SDRAM_DQ3 [sdram]: IC9.54(_BANK3:PIN54) ; also sheet 3
SDRAM_DQ4 [sdram]: IC9.32(_BANK2:PIN31) ; also sheet 3
SDRAM_DQ5 [sdram]: IC9.30(_BANK2:PIN30) ; also sheet 3
SDRAM_DQ6 [sdram]: IC9.29(_BANK2:PIN29) ; also sheet 3
SDRAM_DQ7 [sdram]: IC9.28(_BANK2:PIN28) ; also sheet 3
SDRAM_RAS [sdram]: IC9.57(_BANK3:PIN57) ; also sheet 3
SDRAM_WE [sdram]: IC9.55(_BANK3:PIN55) ; also sheet 3
UART0_CBUS0 [signal]: IC9.78(_BANK5:PIN78) ; also sheet 1
UART0_CBUS1 [signal]: IC9.79(_BANK5:PIN79) ; also sheet 1
UART0_RXD [signal]: IC9.81(_BANK5:PIN81) ; also sheet 1
UART0_TXD [signal]: IC9.80(_BANK5:PIN80) ; also sheet 1
UART1_CTS [signal]: IC9.132(_BANK8:PIN132) ; also sheet 1
UART1_DCD [signal]: IC9.127(_BANK8:PIN127) ; also sheet 1
UART1_DSR [signal]: IC9.130(_BANK8:PIN130) ; also sheet 1
UART1_DTR [signal]: IC9.135(_BANK8:PIN135) ; also sheet 1
UART1_RI [signal]: IC9.134(_BANK8:PIN134) ; also sheet 1
UART1_RTS [signal]: IC9.141(_BANK8:PIN141) ; also sheet 1
UART1_RXD [signal]: IC9.131(_BANK8:PIN131) ; also sheet 1
UART1_TXD [signal]: IC9.140(_BANK8:PIN140) ; also sheet 1
VCCA [power]: C44.1 C45.1 C46.1 C47.1 C48.1 FB2.2 IC9.2(_PWR:VCCA6) IC9.34(_PWR:VCCA2) IC9.35(_PWR:VCCA1) IC9.71(_PWR:VCCA5) IC9.107(_PWR:VCCA3) IC9.143(_PWR:VCCA4)
VGA_B0 [signal]: IC9.106(_BANK6:PIN106) ; also sheet 1
VGA_B1 [signal]: IC9.105(_BANK6:PIN105) ; also sheet 1
VGA_G0 [signal]: IC9.112(_BANK7:PIN112) ; also sheet 1
VGA_G1 [signal]: IC9.111(_BANK7:PIN111) ; also sheet 1
VGA_G2 [signal]: IC9.110(_BANK7:PIN110) ; also sheet 1
VGA_HS [signal]: IC9.120(_BANK8:PIN120) ; also sheet 1
VGA_R0 [signal]: IC9.118(_BANK7:PIN118) ; also sheet 1
VGA_R1 [signal]: IC9.114(_BANK7:PIN114) ; also sheet 1
VGA_R2 [signal]: IC9.113(_BANK7:PIN113) ; also sheet 1
VGA_VS [signal]: IC9.119(_BANK7:PIN119) ; also sheet 1
Unconnected: IC9.5(_ADC:ADC_VREF)

### Notes on the sheet
- FPGA

## Sheet 6 of 6
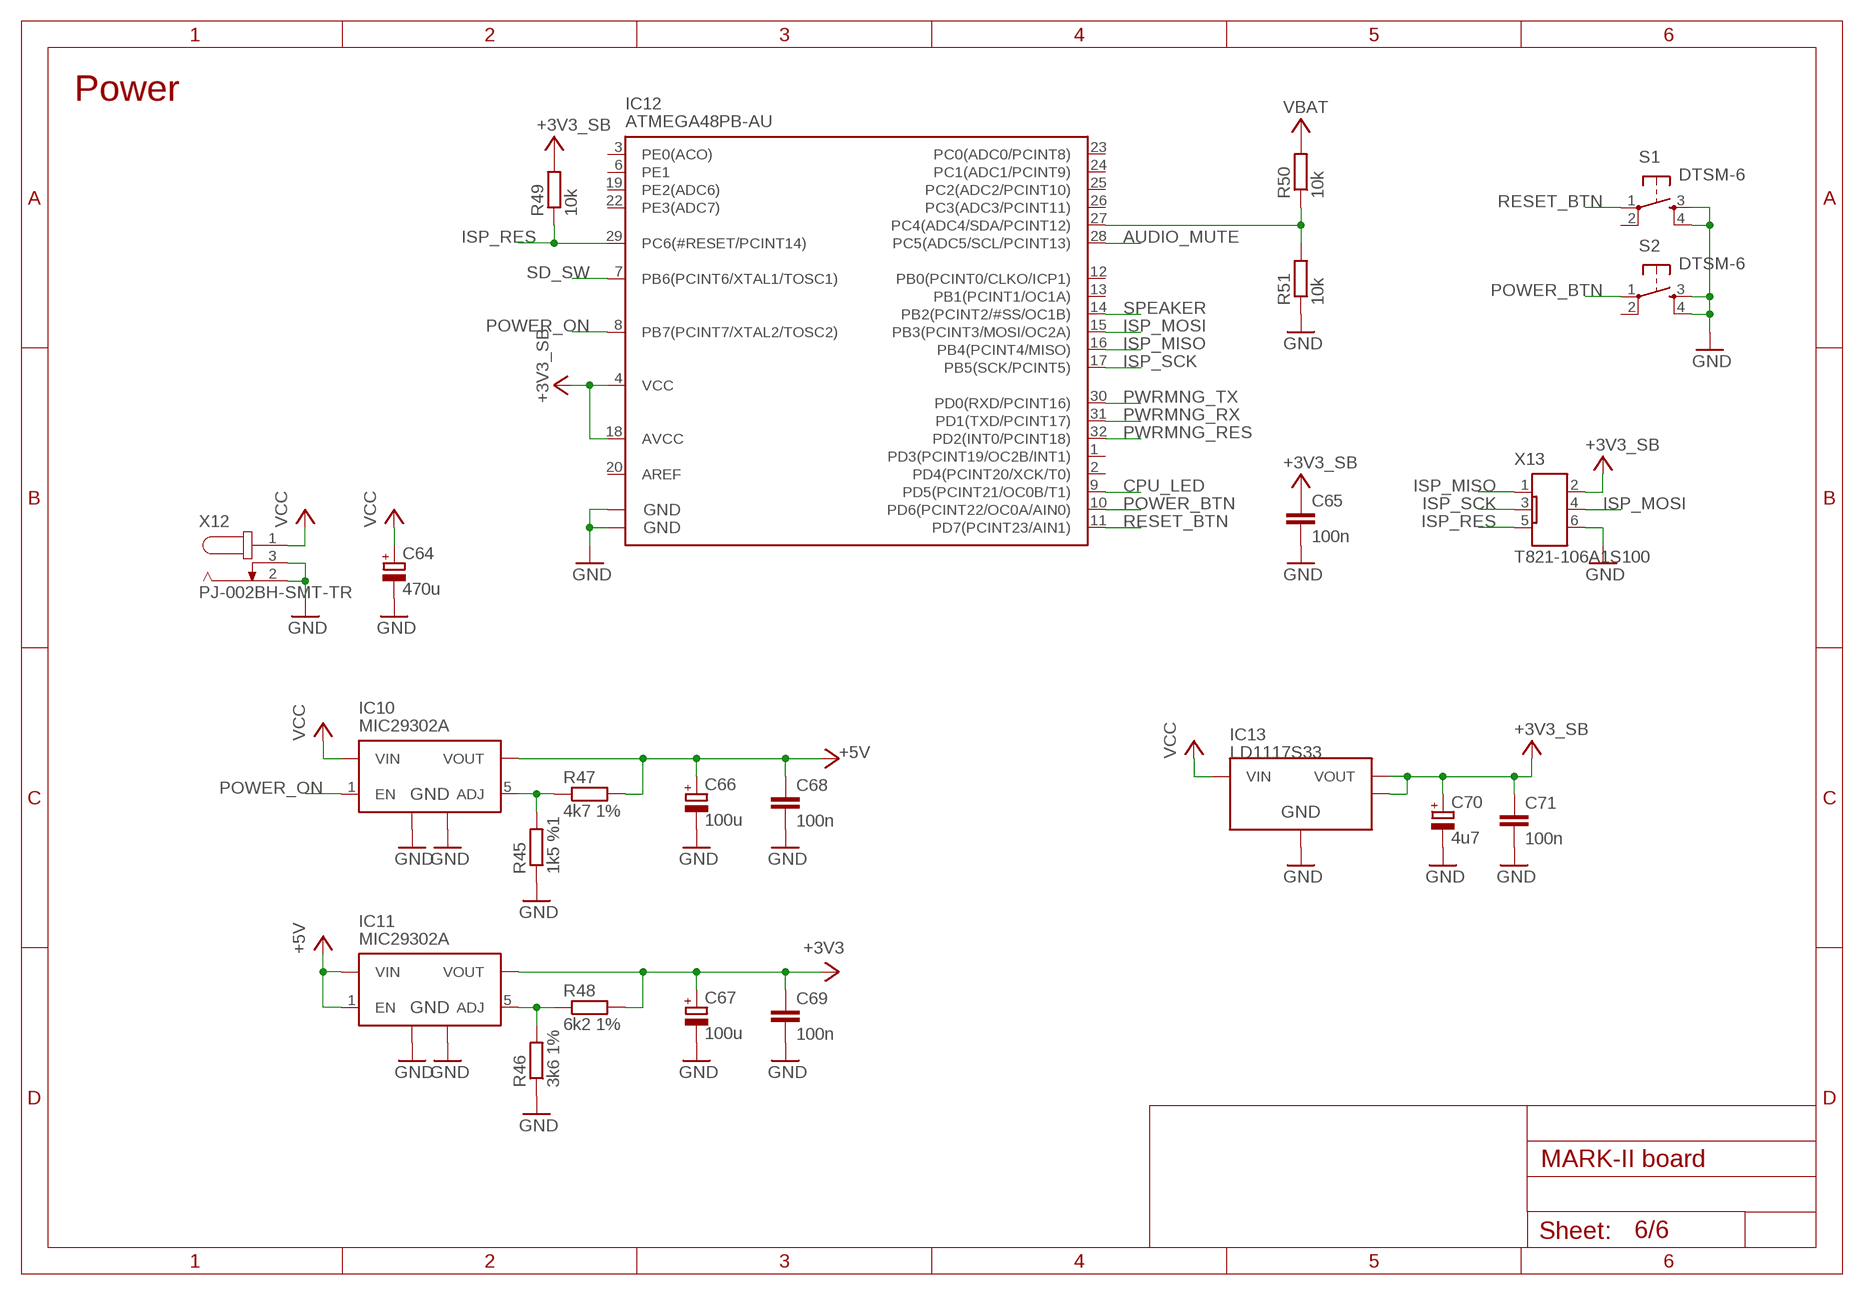
[diagram p5: schematic, sheet 6]

### Parts
C64  470u  C-POLE3.5-8  [E3,5-8]
C65  100n  CC0603  [C0603]
C66  100u  C-POLE2.5-7  [E2,5-7]
C67  100u  C-POLE2.5-7  [E2,5-7]
C68  100n  CC0603  [C0603]
C69  100n  CC0603  [C0603]
C70  4u7  C-POLE2.5-5  [E2,5-5]
C71  100n  CC0603  [C0603]
IC10  MIC29302A  IFX1963TBV  [D2PAK-5]
IC11  MIC29302A  IFX1963TBV  [D2PAK-5]
IC12  ATMEGA48PB-AU  [TQFP32-08]
IC13  LD1117S33  [SOT223]
R45  1k5 %1  RR0603  [R0603]
R46  3k6 1%  RR0603  [R0603]
R47  4k7 1%  RR0603  [R0603]
R48  6k2 1%  RR0603  [R0603]
R49  10k  RR0603  [R0603]
R50  10k  RR0603  [R0603]
R51  10k  RR0603  [R0603]
S1  DTSM-6  [DTSM-6]
S2  DTSM-6  [DTSM-6]
X12  PJ-002BH-SMT-TR  PJ-002BH-SMT  [PJ-002BH-SMT]
X13  T821-106A1S100  IDC_2306  [PAK100/2300-06]

### Nets
+3V3 [power]: C67.+ C69.1 IC11.4(VOUT) R48.2 ; also sheet 1,2,3,4,5
+3V3_SB [power]: C65.1 C70.+ C71.1 IC12.4(VCC) IC12.18(AVCC) IC13.2(VOUT) IC13.4(P) R49.2 X13.2 ; also sheet 3
+5V [power]: C66.+ C68.1 IC10.4(VOUT) IC11.1(EN) IC11.2(VIN) R47.2 ; also sheet 1,4
AUDIO_MUTE [signal]: IC12.28(PC5(ADC5/SCL/PCINT13)) ; also sheet 2
CPU_LED [signal]: IC12.9(PD5(PCINT21/OC0B/T1)) ; also sheet 4
GND [power]: C64.- C65.2 C66.- C67.- C68.2 C69.2 C70.- C71.2 IC10.3(GND) IC10.P IC11.3(GND) IC11.P IC12.5(GND) IC12.21(GND) IC13.1(GND) R45.1 R46.1 R51.1 S1.3 S1.4 S2.3 S2.4 X12.2 X12.3 X13.6 ; also sheet 1,2,3,4,5
ISP_MISO [signal]: IC12.16(PB4(PCINT4/MISO)) X13.1
ISP_MOSI [signal]: IC12.15(PB3(PCINT3/MOSI/OC2A)) X13.4
ISP_RES [signal]: IC12.29(PC6(#RESET/PCINT14)) R49.1 X13.5
ISP_SCK [signal]: IC12.17(PB5(SCK/PCINT5)) X13.3
N$21 [signal]: IC12.27(PC4(ADC4/SDA/PCINT12)) R50.1 R51.2
N$28 [signal]: IC11.5(ADJ) R46.2 R48.1
N$30 [signal]: IC10.5(ADJ) R45.2 R47.1
POWER_BTN [signal]: IC12.10(PD6(PCINT22/OC0A/AIN0)) S2.1 ; also sheet 4
POWER_ON [signal]: IC10.1(EN) IC12.8(PB7(PCINT7/XTAL2/TOSC2)) ; also sheet 4
PWRMNG_RES [signal]: IC12.32(PD2(INT0/PCINT18)) ; also sheet 5
PWRMNG_RX [signal]: IC12.31(PD1(TXD/PCINT17)) ; also sheet 5
PWRMNG_TX [signal]: IC12.30(PD0(RXD/PCINT16)) ; also sheet 5
RESET_BTN [signal]: IC12.11(PD7(PCINT23/AIN1)) S1.1 ; also sheet 4
SD_SW [signal]: IC12.7(PB6(PCINT6/XTAL1/TOSC1)) ; also sheet 3
SPEAKER [signal]: IC12.14(PB2(PCINT2/#SS/OC1B)) ; also sheet 4
VBAT [vbat]: R50.2 ; also sheet 3
VCC [power]: C64.+ IC10.2(VIN) IC13.3(VIN) X12.1 ; also sheet 4
Unconnected: IC12.1(PD3(PCINT19/OC2B/INT1)) IC12.2(PD4(PCINT20/XCK/T0)) IC12.3(PE0(ACO)) IC12.6(PE1) IC12.12(PB0(PCINT0/CLKO/ICP1)) IC12.13(PB1(PCINT1/OC1A)) IC12.19(PE2(ADC6)) IC12.20(AREF) IC12.22(PE3(ADC7)) IC12.23(PC0(ADC0/PCINT8)) IC12.24(PC1(ADC1/PCINT9)) IC12.25(PC2(ADC2/PCINT10)) IC12.26(PC3(ADC3/PCINT11)) S1.2 S2.2

### Notes on the sheet
- Power

## Library data of the parts
C1 C2 C5-C16 C18 C23-C25 C28-C34 C37-C63 C65 C68 C69 C71 = misc:C: CAPACITOR, European symbol; MOUSER: 710-885012206046
C3 C4 = misc:C: CAPACITOR, European symbol; MOUSER: 77-VJ0603A470JXACBC
C17 = misc:C: CAPACITOR, European symbol; MOUSER: 963-LMK107BBJ106KALT
C19 C20 = misc:C: CAPACITOR, European symbol; MOUSER: 81-GRM188R61E225KA2D
C21 C22 = misc:C: CAPACITOR, European symbol; MOUSER: 710-885012006017
C26 C27 = misc:C: CAPACITOR, European symbol; MOUSER: 710-885012206085
C35 C36 = misc:C: CAPACITOR, European symbol; MOUSER: 77-VJ0603A120JXACBC
C64 = misc:C-POL: POLARIZED CAPACITOR, European symbol; MOUSER: 667-EEU-FR1E471Y
C66 C67 = misc:C-POL: POLARIZED CAPACITOR, European symbol; MOUSER: 140-RGA101M1EBK0611G
C70 = misc:C-POL: POLARIZED CAPACITOR, European symbol; MOUSER: 667-ECA-1HM4R7I
FB1 FB2 = misc:FERRITE_BEAD: Ferrite bead; MOUSER: 81-BLM11A601S
IC1 = ic:MAX3243*: RS-232 Transceivers with AutoShutdown 1µA Supply-Current, True +3V to +5.5V http://dbserv.maxim-ic.com/; MOUSER: 595-MAX3243CPWR
IC2 = ic:FT230X: USB to BASIC UART IC Auto generated by make-symbol-device-package-bsdl.ulp Rev. 43 Source: Data sheet <http://www.ftdichip.com/Support/Documents/DataSheets/ICs/DS_FT230X.pdf>; MOUSER: 895-FT230XS-R
IC3 = ic:ENC28J60: Stand-Alone Ethernet Controller with SPI Interface Source: http://ww1.microchip.com/downloads/en/DeviceDoc/39662c.pdf; MOUSER: 579-ENC28J60-I/SS
IC4 = ic:PCM5100: 2V RMS DirectPathTM, 112/106/100dB Audio Stereo DAC with 32-bit, 384kHz PCM Interface; MOUSER: 595-PCM5100APWR
IC5 = ic:IS42S83200; MOUSER: 913-AS4C32M8SA6TIN
IC6 = ic:MCP7940N: Low-Cost I2C Real-Time Clock/Calendar with SRAM and Battery Switchover; MOUSER: 579-MCP7940N-I/SN
IC7 = ic:FM24CL16B: 2kx8 Serial I2C F-RAM; MOUSER: 877-FM24CL16B-G
IC8 = ic:AT25DN256: 256-Kbit, 2.3V Minimum SPI Serial Flash Memory with Dual-Read Support; MOUSER: 988-AT25DN256-SSHF-B
IC9 = MAX:10M25SAE144: Intel MAX 10 FPGA MAX ® 10 devices are single-chip, non-volatile low-cost programmable logic devices (PLDs) to integrate the optimal set of system components. * Internally stored dual configuration flash * User flash memory * Instant on support * Integrated analog-to-digital converters (ADCs) * Single-chip Nios II soft core processor support 10M25SA Features: * 25k LE * 75 M9K * 55 18x18 multiplier * 1 PLL; MOUSER: 989-10M25SAE144C8G
IC10 IC11 = vreg:IFX1963: 1.5A Low Dropout Linear Voltage Regulator; MOUSER: 998-MIC29302AWU
IC12 = ic:ATMEGA48PB; MOUSER: 556-ATMEGA48PB-AU
IC13 = vreg:LD1117: 1.2 A high PSRR low-dropout linear voltage regulator; MOUSER: 511-LD1117S33
LED1-LED3 = misc:LED; MOUSER: 604-APT3216EC
Q1 = oscil:CRYSTALS-GND-LID: CRYSTALS WITH CAN GROUNDED; MOUSER: 449-LFXTAL035268REEL
Q2 = oscil:CRYSTALS-NOGND: CRYSTALS CAN NOT GROUNDED; MOUSER: 449-LFXTAL003000REEL
Q3 = misc:CMI-1275C-050: CMI-1275C-050 MAGNETIC BUZZER INDICATOR; MOUSER: 490-CMI-1275C-050
Q4 = oscil:OSC-OE: OSCILLATOR WITH OE; MOUSER: 449-LFSPXO018077REEL
Q5 = oscil:OSC-OE: OSCILLATOR WITH OE; MOUSER: 449-LFSPXO021101REEL
Q6 = oscil:OSC-OE: OSCILLATOR WITH OE; MOUSER: 449-LFSPXO023492BULK
R1 R2 = misc:R: RESISTOR, European symbol; MOUSER: 652-CR0603-JW-270ELF
R3 R33 R34 R47 = misc:R: RESISTOR, European symbol; MOUSER: 603-RC0603FR-074K7L
R4 R32 R36 R37 R41-R44 R49-R51 = misc:R: RESISTOR, European symbol; MOUSER: 71-CRCW060310K0JNEAC
R5 R35 = misc:R: RESISTOR, European symbol; MOUSER: 652-CR0603-FX3300GLF
R6 R9 R28 R29 = misc:R: RESISTOR, European symbol; MOUSER: 71-CRCW0603470RJNEB
R7 R10 R38-R40 = misc:R: RESISTOR, European symbol; MOUSER: 71-CRCW06031K00FKEAC
R8 R11 R19-R22 = misc:R: RESISTOR, European symbol; MOUSER: 603-RC0603FR-072K2L
R12-R14 = misc:R: RESISTOR, European symbol; MOUSER: 603-AC0603JR-07820RL
R15-R18 = misc:R: RESISTOR, European symbol; MOUSER: 652-CR0603-JW-121ELF
R23 = misc:R: RESISTOR, European symbol; MOUSER: 603-RC0603FR-072K32L
R24-R27 = misc:R: RESISTOR, European symbol; MOUSER: 603-RC0603FR-0749R9L
R30 R31 = misc:R: RESISTOR, European symbol; MOUSER: 71-CRCW0603220RFKEB
R45 = misc:R: RESISTOR, European symbol; MOUSER: 71-CRCW06031K50FKEB
R46 = misc:R: RESISTOR, European symbol; MOUSER: 603-RC0603FR-073K6L
R48 = misc:R: RESISTOR, European symbol; MOUSER: 652-CR0603FX-6201ELF
S1 S2 = switch:DTSM-6; FARNELL: 2396053
SJ1-SJ6 = jumper:SJ2W: SMD solder JUMPER
T1 = misc:BC337: NPN Transistor; MOUSER: 821-BC337-16-A1
X1 = con:MINI-USB; MOUSER: 798-UX60A-MB-5ST
X2 = con:M09: SUB-D; FARNELL: 1848368
X3 = con:HF15: SUB-D; FARNELL: 2401183; MOUSER: 523-L77HDE15SD1CH4R
X4 = con:MINIDIN_6; MOUSER: 490-MD-60SM
X5 = con:RB1-125BAG1A; MOUSER: 950-RB1-125BAG1A
X6 = con:SJ1-3535NG: 3.5 MM AUDIO JACKS; MOUSER: 490-SJ1-3535NG-GR
X7 = con:MICROSD-HRS_DM3D; MOUSER: 798-DM3D-SF
X8 = con:BAT-HLD-002-SMT; MOUSER: 712-BAT-HLD-002-SMT
X9 = cons_3m:2520-: 3M (TM) Pak 100 4-Wall Header Source: 3M; FARNELL: 2215309
X10 X13 = con:IDC_2306; FARNELL: 2215302
X11 = cons_3m:2510-: 3M (TM) Pak 100 4-Wall Header Source: 3M; FARNELL: 2215304
X12 = con:PJ-002BH-SMT; MOUSER: 490-PJ-002BH-SMT-TR

## Net classes
1 power: width 0.254 mm, drill 0.35 mm
2 signal: width 0.203 mm, drill 0.35 mm
3 sdram: width 0.127 mm, drill 0.35 mm
4 vbat: width 0.203 mm, drill 0.35 mm